# Altium schematic sheet gain.SchDoc
size A; SheetNumber: 6; SheetTotal: 6
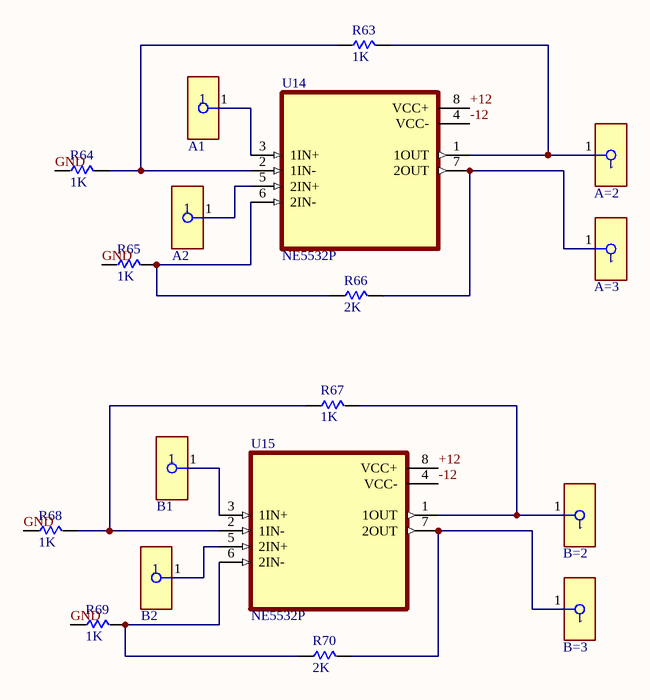
[diagram p0: gain.SchDoc]

## Parts
A1  1581-5  [FP-1581-5-MFG]  (value not drawn)
A2  1581-5  [FP-1581-5-MFG]  (value not drawn)
A=2  1581-5  [FP-1581-5-MFG]  (value not drawn)
A=3  1581-5  [FP-1581-5-MFG]  (value not drawn)
B1  1581-5  [FP-1581-5-MFG]  (value not drawn)
B2  1581-5  [FP-1581-5-MFG]  (value not drawn)
B=2  1581-5  [FP-1581-5-MFG]  (value not drawn)
B=3  1581-5  [FP-1581-5-MFG]  (value not drawn)
R63  value 1K  [RESAD1100W55L680D260]  (hidden comment: MFR-25FBF52-1K)
R64  value 1K  [RESAD1100W55L680D260]  (hidden comment: MFR-25FBF52-1K)
R65  value 1K  [RESAD1100W55L680D260]  (hidden comment: MFR-25FBF52-1K)
R66  value 2K  [RESAD1100W55L680D260]  (hidden comment: MFR-25FBF52-1K)
R67  value 1K  [RESAD1100W55L680D260]  (hidden comment: MFR-25FBF52-1K)
R68  value 1K  [RESAD1100W55L680D260]  (hidden comment: MFR-25FBF52-1K)
R69  value 1K  [RESAD1100W55L680D260]  (hidden comment: MFR-25FBF52-1K)
R70  value 2K  [RESAD1100W55L680D260]  (hidden comment: MFR-25FBF52-1K)
U14  NE5532P  [DIP794W45P254L959H508Q8]
U15  NE5532P  [DIP794W45P254L959H508Q8]

## Nets
+12: U14.8(VCC+) U15.8(VCC+)
-12: U14.4(VCC-) U15.4(VCC-)
GND: R64.1 R65.1 R68.1 R69.1
NetA1_1: A1.1 U14.3(1IN+)
NetA2_1: A2.1 U14.5(2IN+)
NetA=2_1: A=2.1 R63.2 U14.1(1OUT)
NetA=3_1: A=3.1 R66.2 U14.7(2OUT)
NetB1_1: B1.1 U15.3(1IN+)
NetB2_1: B2.1 U15.5(2IN+)
NetB=2_1: B=2.1 R67.2 U15.1(1OUT)
NetB=3_1: B=3.1 R70.2 U15.7(2OUT)
NetR63_1: R63.1 R64.2 U14.2(1IN-)
NetR65_2: R65.2 R66.1 U14.6(2IN-)
NetR67_1: R67.1 R68.2 U15.2(1IN-)
NetR69_2: R69.2 R70.1 U15.6(2IN-)

## Library data of the parts
A1 A2 A=2 A=3 B1 B2 B=2 B=3 = CMP-73906-000011-1: CONN BANANA JACK TURRET GREEN; Body Material: PC; Number of Contacts: 1; Max Current Rating: 15A; Voltage Rating (AC): 30V; Insulation: Mating End Insulated; Voltage Rating: 2.5kV; Voltage Rating (DC): 60V; Gender: Female; Height: 0.25inch; Mount: Panel; RoHS Compliant: Yes; Length: 1.22inch; Orientation: Straight; Diameter: 4.22mm; Lead Free: Lead Free; Package Quantity: 1; Termination: Turret; Current Rating: 15A; Packaging: Bag; Series: 1581; REACH SVHC: No SVHC; Number of Positions: 1; Contact Plating: Tin; Housing Color: Green; Contact Material: Brass; Insulation Material: Polycarbonate; Weight: 0.126lb; Number of Ports: 1; Color: Green; Housing Material: Polycarbonate; Width: 4inch
R63-R70 = MFR-25FBF52-1K: 1.07 kOhms Â±1% 0.25W, 1/4W Through Hole Resistor Axial - Metal Film; MF: Yageo; SnapEDA_Link: https://www.snapeda.com/parts/MFR-25FBF52-1K/Yageo/view-part/?ref=snap; Package: RADIAL-2 YAGEO; MP: MFR-25FBF52-1K; Check_prices: https://www.snapeda.com/parts/MFR-25FBF52-1K/Yageo/view-part/?ref=eda
U14 U15 = NE5532P: Dual, 30-V, 10-MHz, low-noise operational amplifier for audio applications; MF: Texas Instruments; SnapEDA_Link: https://www.snapeda.com/parts/NE5532P/Texas+Instruments/view-part/?ref=snap; Package: PDIP-8 Texas; Value: *; MP: NE5532P; Check_prices: https://www.snapeda.com/parts/NE5532P/Texas+Instruments/view-part/?ref=eda